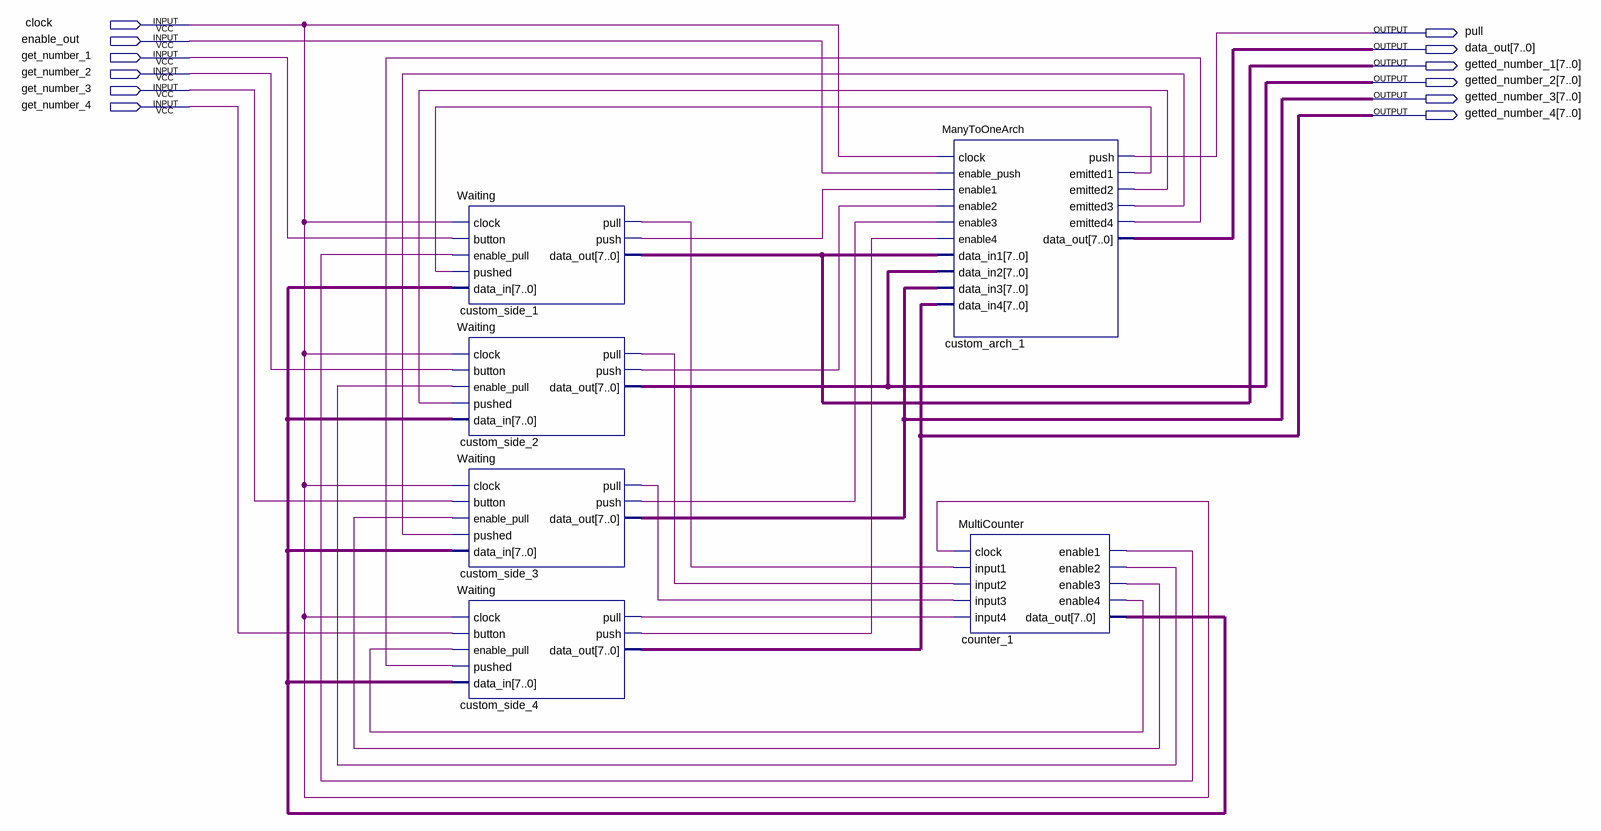
[diagram p0: schematic sheet]
// Quartus schematic Customs.bdf as structural Verilog: 6 symbols, 12 pins
module Customs (
  input  clock,
  input  enable_out,
  input  get_number_1,
  input  get_number_2,
  input  get_number_3,
  input  get_number_4,
  output pull,
  output [7:0] data_out,
  output [7:0] getted_number_1,
  output [7:0] getted_number_2,
  output [7:0] getted_number_3,
  output [7:0] getted_number_4
);

  wire counter_1_enable1, counter_1_enable2, counter_1_enable3, counter_1_enable4, custom_arch_1_emitted1,
       custom_arch_1_emitted2, custom_arch_1_emitted3, custom_arch_1_emitted4, custom_side_1_pull,
       custom_side_1_push, custom_side_2_pull, custom_side_2_push, custom_side_3_pull, custom_side_3_push,
       custom_side_4_pull, custom_side_4_push;
  wire [7:0] counter_1_data_out;

  Waiting custom_side_1 (
    .clock(clock), .button(get_number_1), .enable_pull(counter_1_enable1), .pushed(custom_arch_1_emitted1),
    .data_in(counter_1_data_out), .pull(custom_side_1_pull), .push(custom_side_1_push),
    .data_out(getted_number_1));
  Waiting custom_side_2 (
    .clock(clock), .button(get_number_2), .enable_pull(counter_1_enable2), .pushed(custom_arch_1_emitted2),
    .data_in(counter_1_data_out), .pull(custom_side_2_pull), .push(custom_side_2_push),
    .data_out(getted_number_2));
  Waiting custom_side_3 (
    .clock(clock), .button(get_number_3), .enable_pull(counter_1_enable3), .pushed(custom_arch_1_emitted3),
    .data_in(counter_1_data_out), .pull(custom_side_3_pull), .push(custom_side_3_push),
    .data_out(getted_number_3));
  Waiting custom_side_4 (
    .clock(clock), .button(get_number_4), .enable_pull(counter_1_enable4), .pushed(custom_arch_1_emitted4),
    .data_in(counter_1_data_out), .pull(custom_side_4_pull), .push(custom_side_4_push),
    .data_out(getted_number_4));
  ManyToOneArch custom_arch_1 (
    .clock(clock), .enable_push(enable_out), .enable1(custom_side_1_push), .enable2(custom_side_2_push),
    .enable3(custom_side_3_push), .enable4(custom_side_4_push), .data_in1(getted_number_1),
    .data_in2(getted_number_2), .data_in3(getted_number_3), .data_in4(getted_number_4), .push(pull),
    .emitted1(custom_arch_1_emitted1), .emitted2(custom_arch_1_emitted2), .emitted3(custom_arch_1_emitted3),
    .emitted4(custom_arch_1_emitted4), .data_out(data_out));
  MultiCounter counter_1 (
    .clock(clock), .input1(custom_side_1_pull), .input2(custom_side_2_pull), .input3(custom_side_3_pull),
    .input4(custom_side_4_pull), .enable1(counter_1_enable1), .enable2(counter_1_enable2),
    .enable3(counter_1_enable3), .enable4(counter_1_enable4), .data_out(counter_1_data_out));
endmodule
